# EasyEDA Pro project SCH.epro

# Schematic 【蓝桥杯练习题三】智能平衡小车
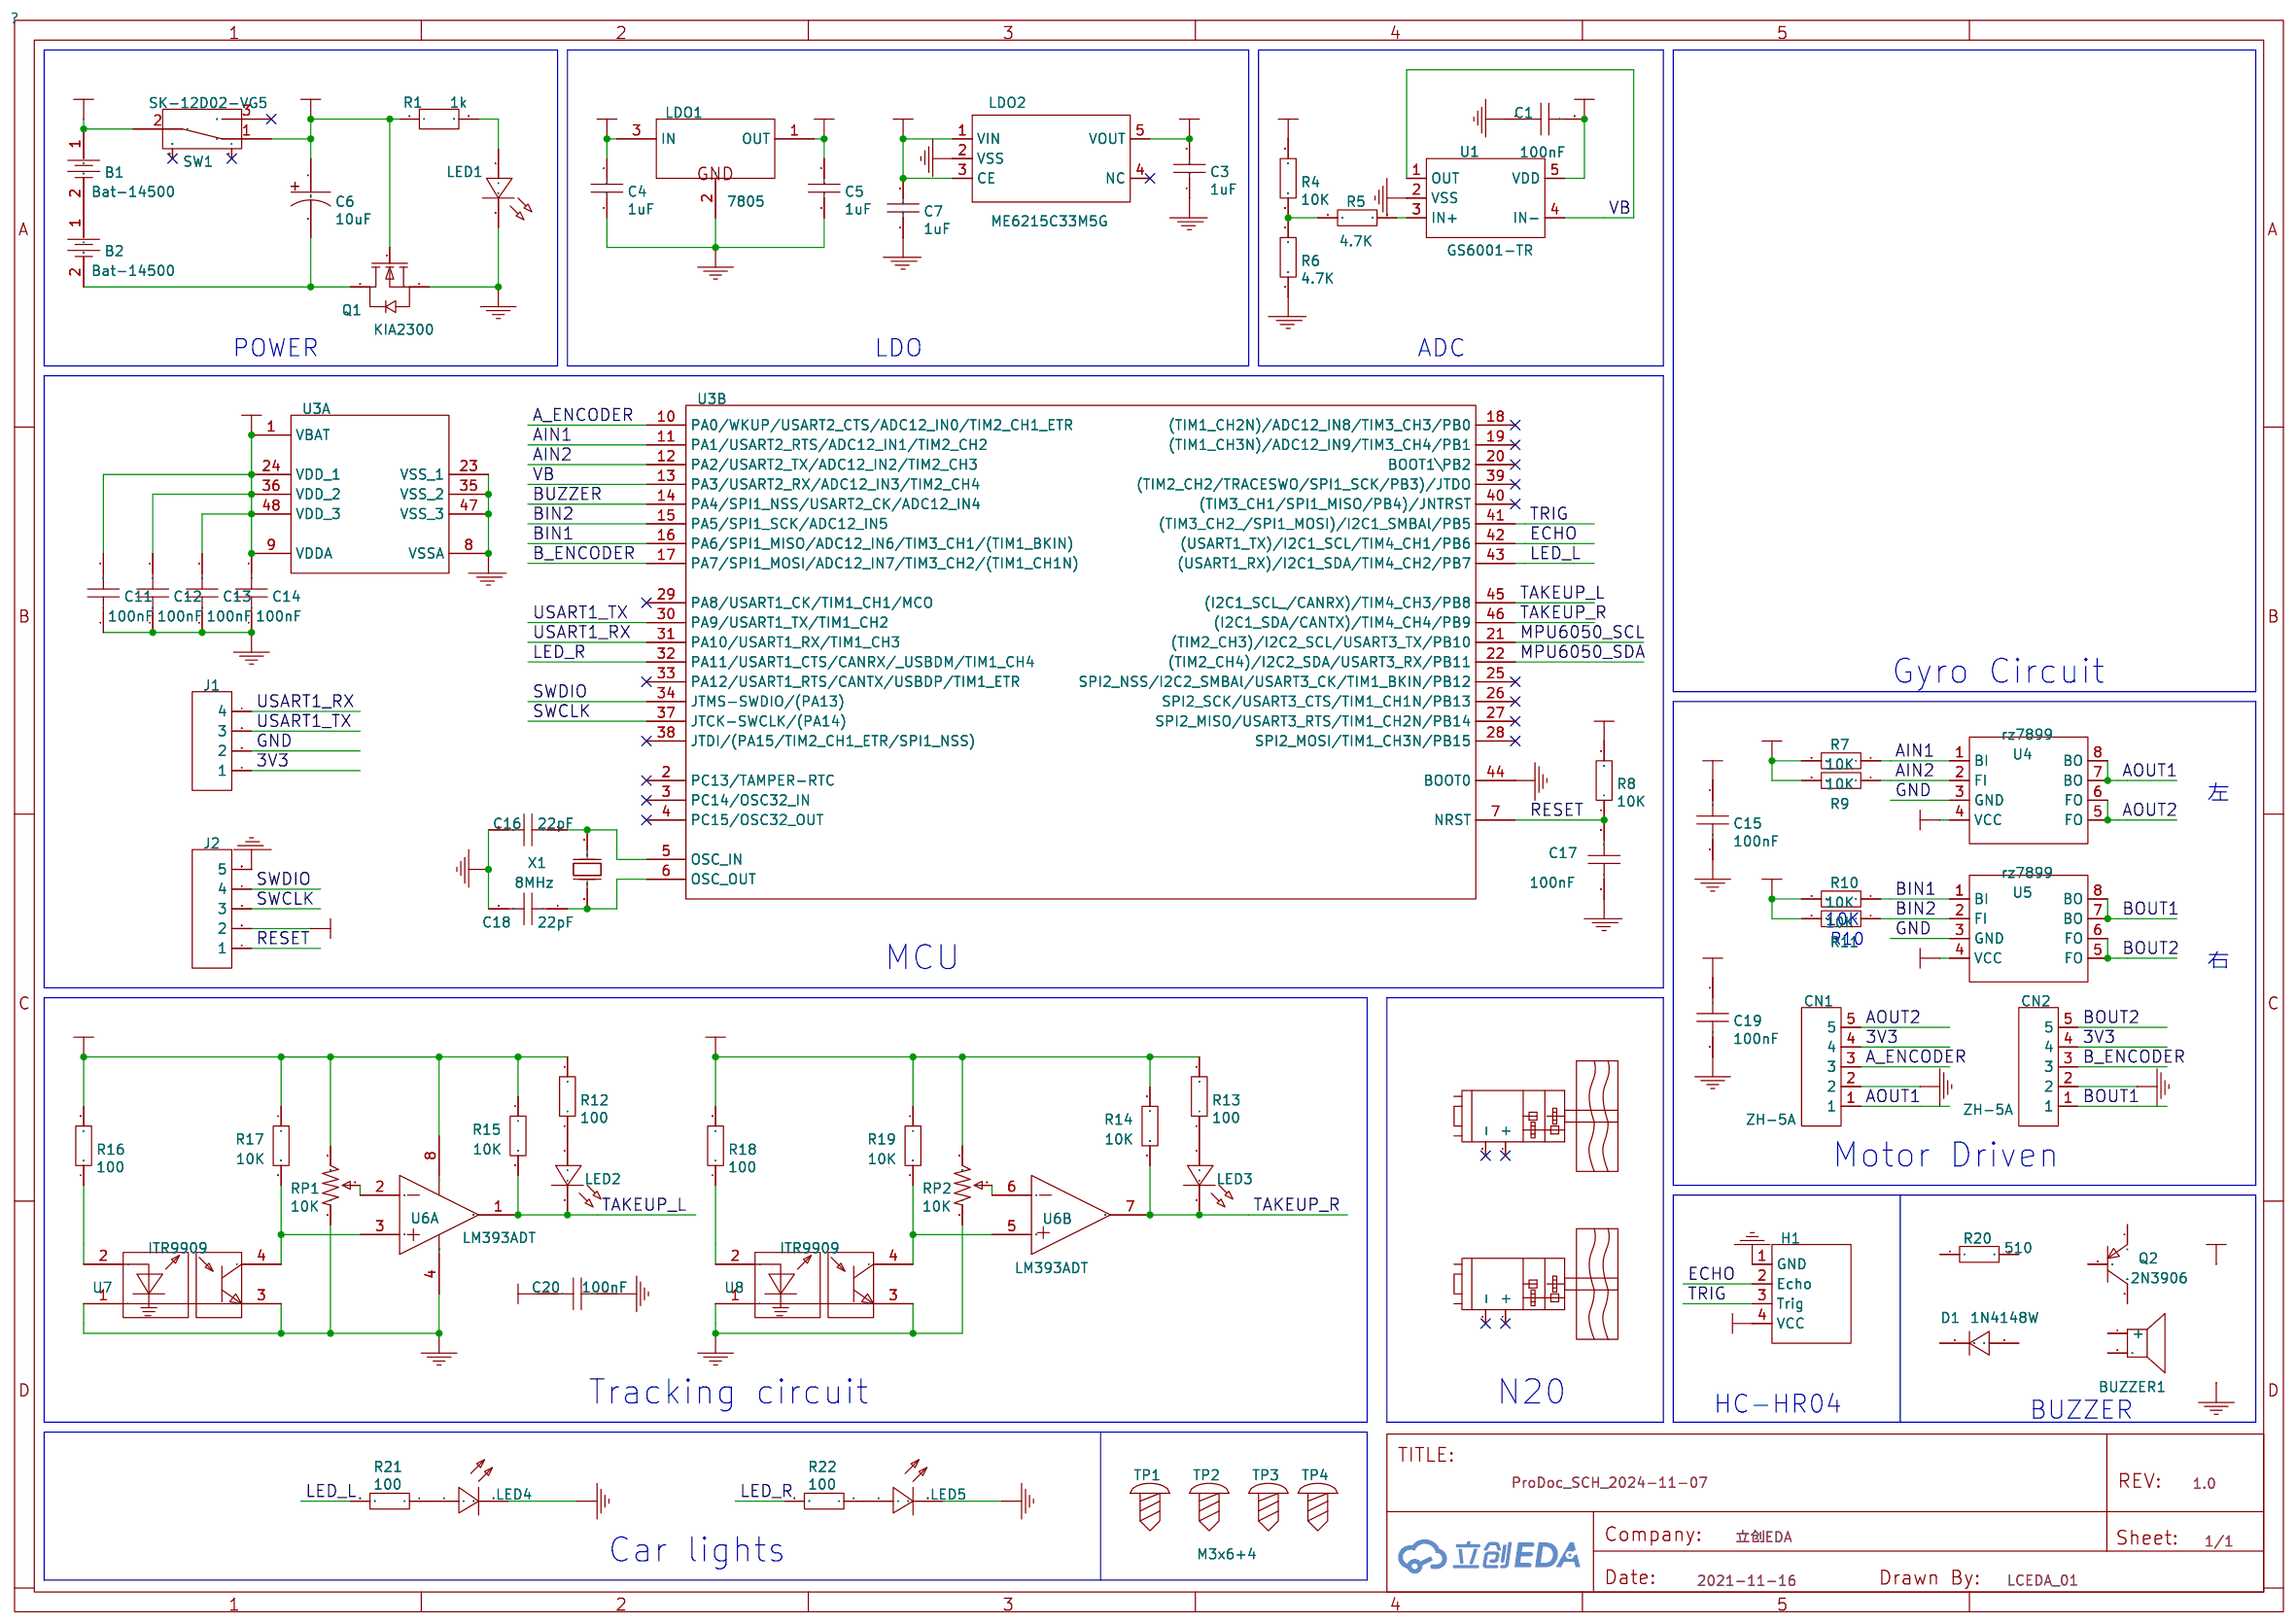
[diagram p0: schematic sheet]

## Parts
ASS_1  直流电机N20  [直流电机N20_水平装配]
ASS_2  直流电机N20  [直流电机N20_水平装配]
B1  Bat-14500  [BAT-5AA_JX]
B2  Bat-14500  [BAT-5AA_JX]
BUZZER1  TMB12A12  [BUZ-TH_BD12.0-P7.60-D0.6-FD]
C1  100nF  [C0603]
C3  1uF  [C0603]
C4  1uF  [C0603]
C5  1uF  [C0603]
C6  10uF  [CAP-SMD_L3.2-W1.6]
C7  1uF  [C0603]
C11  100nF  [C0603]
C12  100nF  [C0603]
C13  100nF  [C0603]
C14  100nF  [C0603]
C15  100nF  [C0603]
C16  22pF  [C0603]
C17  100nF  [C0603]
C18  22pF  [C0603]
C19  100nF  [C0603]
C20  100nF  [C0603]
CN1  ZH-5A  [CONN-TH_5P-P1.50_ZH-5A]
CN2  ZH-5A  [CONN-TH_5P-P1.50_ZH-5A]
D1  1N4148W  [SOD-123FL_L2.6-W1.6-LS3.4-RD]
H1  超声波测距模块_HC-HR04  [HC-HR04]
J1  HDR-M-2.54_1x4  [HDR-M-2.54_1X4]
J2  HDR-M-2.54_1x5  [HDR-M-2.54_1X5]
LDO1  7805  [SOT-89-3_L4.5-W2.5-P1.50-LS4.2-BR]
LDO2  ME6215C33M5G  [SOT-23-5_L3.0-W1.7-P0.95-LS2.8-BR]
LED1  LED-0603_R  [LED0603_RED]
LED2  LED-0805_G  [LED0603_GREEN]
LED3  LED-0805_G  [LED0603_GREEN]
LED4  TJ-L5FCMYGTDLSFLC6TW-A5  [LED-TH-5MM_P2.54-L]
LED5  TJ-L5FCMYGTDLSFLC6TW-A5  [LED-TH-5MM_P2.54-L]
Q1  KIA2300  [SOT-23_L2.9-W1.3-P1.90-LS2.4-BR]
Q2  2N3906  [SOT-23-3_L2.9-W1.6-P1.90-LS2.8-TR-CW]
R1  1k  [R0603]
R4  10K  [R0603]
R5  4.7K  [R0603]
R6  4.7K  [R0603]
R7  10K  [R0603]
R8  10K  [R0603]
R9  10K  [R0603]
R10  10K  [R0603]
R11  10K  [R0603]
R12  100  [R0603]
R13  100  [R0603]
R14  10K  [R0603]
R15  10K  [R0603]
R16  100  [R0603]
R17  10K  [R0603]
R18  100  [R0603]
R19  10K  [R0603]
R20  510  [R0603]
R21  100  [R0603]
R22  100  [R0603]
RP1  10K  [10K贴片可调电阻]
RP2  10K  [10K贴片可调电阻]
SW1  SK-12D02-VG5  [SW-TH_SK-12D02VG3]
TP1  M3x6+4  [M3铜柱]
TP2  M3x6+4  [M3铜柱]
TP3  M3x6+4  [M3铜柱]
TP4  M3x6+4  [M3铜柱]
U1  GS6001-TR  [SOT-23-5_L3.0-W1.7-P0.95-LS2.8-BR]
U3  STM32F103C8T6  [LQFP-48_L7.0-W7.0-P0.50-LS9.0-BL]  (sections 1,2)
U4  rz7899  [SOP-8_L4.9-W3.9-P1.27-LS6.0-BL]
U5  rz7899  [SOP-8_L4.9-W3.9-P1.27-LS6.0-BL]
U6  LM393ADT  [SOIC-8_L4.9-W3.9-P1.27-LS6.0-BL]  (sections 1,2)
U7  ITR9909  [OPTO-TH_ITR9909]
U8  ITR9909  [OPTO-TH_ITR9909]
X1  8MHz  [OSC-SMD_L5.0-W3.2]

## Library data of the parts
ASS_1 ASS_2 = 直流电机N20
B1 B2 = Bat-14500
BUZZER1 = TMB12A12: Supplier: LCSC; Manufacturer: HNDZ; Supplier Part: C96079; JLCPCB Part Class: Extended Part
C1 C11-C15 C17 C19 C20 = 100nF: Supplier: LCSC; Manufacturer: YAGEO; Manufacturer Part: CC0603KRX7R9BB104; Supplier Part: C14663; JLCPCB Part Class: Basic Part
C3-C5 C7 = 1uF: Supplier: LCSC; Manufacturer Part: CC0603KRX5R8BB105; Manufacturer: YAGEO; Supplier Part: C14664; JLCPCB Part Class: Extended Part
C6 = 10uF: Supplier: LCSC; Supplier Part: C185774; Manufacturer: TORCH; Manufacturer Part: CA45-A-16V-10μF-K; JLCPCB Part Class: Extended Part
C16 C18 = 22pF: Supplier: LCSC; Supplier Part: C326840; Manufacturer: YAGEO; Manufacturer Part: CC0603FRNPO9BN220; JLCPCB Part Class: Extended Part
CN1 CN2 = ZH-5A: Supplier: LCSC; Manufacturer: BOOMELE; Supplier Part: C27580; JLCPCB Part Class: Extended Part
D1 = 1N4148W: Supplier: LCSC; Manufacturer: Tak Cheong; Supplier Part: C129216
H1 = 超声波测距模块_HC-HR04
J1 = HDR-M-2.54_1x4: Supplier Part: C124378; Supplier: LCSC
J2 = HDR-M-2.54_1x5: Supplier Part: C358687; Supplier: LCSC
LDO1 = 7805: Supplier: LCSC; Manufacturer: CJ; Manufacturer Part: CJ78L05; image: //image.lceda.cn/szlcsc/C2079.jpg; Supplier Part: C2079; JLCPCB Part Class: Extend
LDO2 = ME6215C33M5G: Supplier: LCSC; Manufacturer: MICRONE; Supplier Part: C84119; JLCPCB Part Class: Extended Part
LED1 = LED-0603_R: Manufacturer: EVERLIGHT(台湾亿光); Manufacturer Part: 19-217/R6C-AL1M2VY/3T; Supplier Part: C72044; Supplier: LCSC
LED2 LED3 = LED-0805_G: Manufacturer: 国星光电; Manufacturer Part: NCD0805G1; Supplier Part: C84260
LED4 LED5 = TJ-L5FCMYGTDLSFLC6TW-A5: Supplier: LCSC; Supplier Part: C331025; Manufacturer: TOGIALED; JLCPCB SMD: Yes; JLCPCB Part Class: Extend
Q1 = KIA2300: Supplier: LCSC; Manufacturer: KIA; Supplier Part: C114186; JLCPCB Part Class: Extended Part
Q2 = 2N3906: Supplier: LCSC; Manufacturer: KEC; Manufacturer Part: 2N3906S-RTK/PS; Supplier Part: C147294
R1 = 1k
R4 R7-R11 R14 R15 R17 R19 = 10K: Supplier: LCSC; Supplier Part: C319939; Manufacturer: Viking Tech; Manufacturer Part: AR03BTCX1002; JLCPCB Part Class: Extended Part
R5 R6 = 4.7K: Supplier: LCSC; Manufacturer: FH; Manufacturer Part: RS-03K4701FT; Supplier Part: C116693; JLCPCB Part Class: Extended Part
R12 R13 R16 R18 R21 R22 = 100: Supplier: LCSC; Manufacturer: FH; Manufacturer Part: RS-03K101JT; Supplier Part: C86983; JLCPCB Part Class: Extended Part
R20 = 510: Supplier: LCSC; Supplier Part: C543964; Manufacturer: PANASONIC; Manufacturer Part: ERJUP3J511V
RP1 RP2 = 10K: Supplier: LCSC; Supplier Part: C515300
SW1 = SK-12D02-VG5: Supplier: LCSC; Supplier Part: C136722; Manufacturer: Rectangular Connectors - Contacts
TP1-TP4 = M3x6+4: Supplier Part: C551320
U1 = GS6001-TR: Supplier: LCSC; Manufacturer: Gainsil; Supplier Part: C157700; JLCPCB Part Class: Extended Part
U3 = STM32F103C8T6: Supplier Part: C8734; Supplier: LCSC
U4 U5 = rz7899: Supplier: LCSC; Manufacturer: RZ; Supplier Part: C92373; JLCPCB Part Class: Extend; JLCPCB SMD: Yes
U6 = LM393ADT: Supplier Part: C136033; Supplier: LCSC; Manufacturer: STMicroelectronics
U7 U8 = ITR9909: Supplier: LCSC; Manufacturer: EVERLIGHT; Supplier Part: C53399; JLCPCB SMD: Yes; JLCPCB Part Class: Extend
X1 = 8MHz: Supplier: LCSC; Manufacturer: YXC; Manufacturer Part: X50328MSB2GI; Supplier Part: C115962; JLCPCB Part Class: Basic Part

## Nets
3V3: C1.2 C3.2 C11.2 C12.2 C13.2 C14.2 C20.1 CN1.4 CN2.4 J1.1 J2.2 LDO2.5(VOUT) R7.2 R8.2 R9.2 R10.2 R11.2 R12.2 R13.2 R14.1 R15.1 R16.2 R17.1 R18.2 R19.1 RP1.3 RP2.3 U1.5(VDD) U3.1(VBAT) U3.9(VDDA) U3.24(VDD_1) U3.36(VDD_2) U3.48(VDD_3) U6.8(V+)
+5V: C5.2 C7.2 H1.4(VCC) LDO1.1(OUT) LDO2.1(VIN) LDO2.3(CE)
GND: C1.1 C3.1 C4.1 C5.1 C7.1 C11.1 C12.1 C13.1 C14.1 C15.2 C16.2 C17.1 C18.2 C19.2 C20.2 CN1.2 CN2.2 H1.1(GND) J1.2 J2.5 LDO1.2(GND) LDO2.2(VSS) LED1.2 LED4.2 LED5.2 Q1.2(S) R6.1 RP1.1 RP2.1 U1.2(VSS) U3.8(VSSA) U3.23(VSS_1) U3.35(VSS_2) U3.44(BOOT0) U3.47(VSS_3) U4.3(GND) U5.3(GND) U6.4(GND) U7.1 U7.3 U8.1 U8.3
VCC: C4.2 C6.1 C15.1 C19.1 LDO1.3(IN) Q1.1(G) R1.1 R4.1 SW1.1 U4.4(VCC) U5.4(VCC)
VCC_IN: B1.1 SW1.2
A_ENCODER: CN1.3 U3.10(PA0/WKUP/USART2_CTS/ADC12_IN0/TIM2_CH1_ETR)
AIN1: R7.1 U3.11(PA1/USART2_RTS/ADC12_IN1/TIM2_CH2) U4.1(BI)
AIN2: R9.1 U3.12(PA2/USART2_TX/ADC12_IN2/TIM2_CH3) U4.2(FI)
AOUT1: CN1.1 U4.7(BO) U4.8(BO)
AOUT2: CN1.5 U4.5(FO) U4.6(FO)
B_ENCODER: CN2.3 U3.17(PA7/SPI1_MOSI/ADC12_IN7/TIM3_CH2/(TIM1_CH1N))
BIN1: R10.1 U3.16(PA6/SPI1_MISO/ADC12_IN6/TIM3_CH1/(TIM1_BKIN)) U5.1(BI)
BIN2: R11.1 U3.15(PA5/SPI1_SCK/ADC12_IN5) U5.2(FI)
BOUT1: CN2.1 U5.7(BO) U5.8(BO)
BOUT2: CN2.5 U5.5(FO) U5.6(FO)
BUZZER: U3.14(PA4/SPI1_NSS/USART2_CK/ADC12_IN4)
ECHO: H1.2(Echo) U3.42((USART1_TX)/I2C1_SCL/TIM4_CH1/PB6)
LED_L: R21.2 U3.43((USART1_RX)/I2C1_SDA/TIM4_CH2/PB7)
LED_R: R22.2 U3.32(PA11/USART1_CTS/CANRX/ USBDM/TIM1_CH4)
MPU6050_SCL: U3.21((TIM2_CH3)/I2C2_SCL/USART3_TX/PB10)
MPU6050_SDA: U3.22((TIM2_CH4)/I2C2_SDA/USART3_RX/PB11)
RESET: C17.2 J2.1 R8.1 U3.7(NRST)
SWCLK: J2.3 U3.37(JTCK-SWCLK/(PA14))
SWDIO: J2.4 U3.34(JTMS-SWDIO/(PA13))
TAKEUP_L: LED2.2 R15.2 U3.45((I2C1_SCL /CANRX)/TIM4_CH3/PB8) U6.1(OUT)
TAKEUP_R: LED3.2 R14.2 U3.46((I2C1_SDA/CANTX)/TIM4_CH4/PB9) U6.7(OUT)
TRIG: H1.3(Trig) U3.41((TIM3_CH2 /SPI1_MOSI)/I2C1_SMBAl/PB5)
USART1_RX: J1.4 U3.31(PA10/USART1_RX/TIM1_CH3)
USART1_TX: J1.3 U3.30(PA9/USART1_TX/TIM1_CH2)
VB: U1.1(OUT) U1.4(IN-) U3.13(PA3/USART2_RX/ADC12_IN3/TIM2_CH4)
Net-(B1-2): B1.2 B2.1
Net-(B2-2): B2.2 C6.2 Q1.3(D)
Net-(C16-1): C16.1 U3.5(OSC_IN) X1.2(OSC2)
Net-(C18-1): C18.1 U3.6(OSC_OUT) X1.1(OSC1)
Net-(LED1-1): LED1.1 R1.2
Net-(LED2-1): LED2.1 R12.1
Net-(LED3-1): LED3.1 R13.1
Net-(LED4-1): LED4.1 R21.1
Net-(LED5-1): LED5.1 R22.1
Net-(R4-2): R4.2 R5.1 R6.2
Net-(R5-2): R5.2 U1.3(IN+)
Net-(R16-1): R16.1 U7.2
Net-(R17-2): R17.2 U6.3(IN+) U7.4
Net-(R18-1): R18.1 U8.2
Net-(R19-2): R19.2 U6.5(IN+) U8.4
Net-(RP1-2): RP1.2 U6.2(IN-)
Net-(RP2-2): RP2.2 U6.6(IN-)

Not connected (* = marked no-connect by the designer): ASS_1 1(+)* 2(-)*; ASS_2 1(+)* 2(-)*; BUZZER1 1(+) 2; D1 1 2; LDO2 4(NC)*; Q2 1(E) 2(B) 3(C); R20 1 2; SW1 3* 4* 5*; U3 2(PC13/TAMPER-RTC)* 3(PC14/OSC32_IN)* 4(PC15/OSC32_OUT)* 18((TIM1_CH2N)/ADC12_IN8/TIM3_CH3/PB0)* 19((TIM1_CH3N)/ADC12_IN9/TIM3_CH4/PB1)* 20(BOOT1\PB2)* 25(SPI2_NSS/I2C2_SMBAl/USART3_CK/TIM1_BKIN/PB12)* 26(SPI2_SCK/USART3_CTS/TIM1_CH1N/PB13)* 27(SPI2_MISO/USART3_RTS/TIM1_CH2N/PB14)* 28(SPI2_MOSI/TIM1_CH3N/PB15)* 29(PA8/USART1_CK/TIM1_CH1/MCO)* 33(PA12/USART1_RTS/CANTX/USBDP/TIM1_ETR)* 38(JTDI/(PA15/TIM2_CH1_ETR/SPI1_NSS))* 39((TIM2_CH2/TRACESWO/SPI1_SCK/PB3)/JTDO)* 40((TIM3_CH1/SPI1_MISO/PB4)/JNTRST)*

## Notes on the sheet
- POWER
- LDO
- ADC
- Gyro Circuit
- 左
- 10K
- R10
- MCU
- 右
- Motor Driven
- Tracking circuit
- N20
- HC-HR04
- BUZZER
- Car lights
